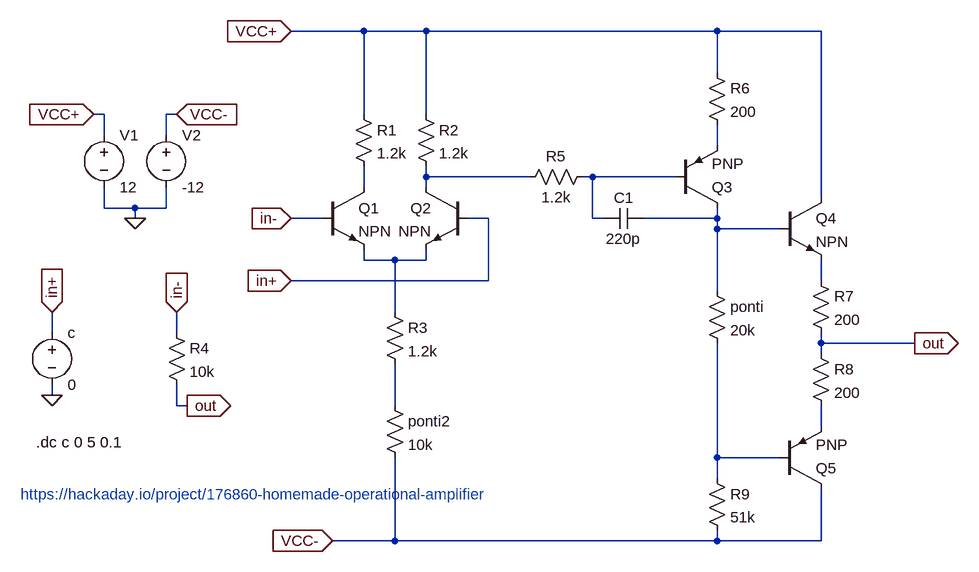
[diagram p0: schematic Discrete Opamp no offest.asc]
Discrete Opamp no offest.asc, the LTspice schematic file:
Version 4
SHEET 1 1092 680
WIRE 176 -160 64 -160
WIRE 272 -160 176 -160
WIRE 720 -160 272 -160
WIRE 880 -160 720 -160
WIRE 720 -96 720 -160
WIRE -224 -32 -240 -32
WIRE -112 -32 -128 -32
WIRE 176 -32 176 -160
WIRE 272 -32 272 -160
WIRE -224 0 -224 -32
WIRE -128 0 -128 -32
WIRE 720 16 720 -16
WIRE 272 64 272 48
WIRE 432 64 272 64
WIRE 528 64 512 64
WIRE 656 64 528 64
WIRE 176 80 176 48
WIRE 272 80 272 64
WIRE 880 96 880 -160
WIRE -224 112 -224 80
WIRE -176 112 -224 112
WIRE -128 112 -128 80
WIRE -128 112 -176 112
WIRE -176 128 -176 112
WIRE 112 128 64 128
WIRE 368 128 336 128
WIRE 528 128 528 64
WIRE 544 128 528 128
WIRE 720 128 720 112
WIRE 720 128 608 128
WIRE 720 144 720 128
WIRE 816 144 720 144
WIRE 176 192 176 176
WIRE 224 192 176 192
WIRE 272 192 272 176
WIRE 272 192 224 192
WIRE 368 224 368 128
WIRE 368 224 64 224
WIRE 880 224 880 192
WIRE 720 240 720 144
WIRE 224 272 224 192
WIRE -304 304 -304 272
WIRE -112 304 -112 272
WIRE 880 320 880 304
WIRE 1024 320 880 320
WIRE 880 336 880 320
WIRE -304 400 -304 384
WIRE -112 416 -112 384
WIRE -96 416 -112 416
WIRE 224 416 224 352
WIRE 880 448 880 416
WIRE 720 496 720 320
WIRE 816 496 720 496
WIRE 720 528 720 496
WIRE 224 624 224 496
WIRE 224 624 128 624
WIRE 720 624 720 608
WIRE 720 624 224 624
WIRE 880 624 880 544
WIRE 880 624 720 624
FLAG 1024 320 out
IOPIN 1024 320 Out
FLAG 64 224 in+
IOPIN 64 224 In
FLAG 64 128 in-
IOPIN 64 128 In
FLAG 64 -160 VCC+
IOPIN 64 -160 In
FLAG 128 624 VCC-
IOPIN 128 624 In
FLAG -240 -32 VCC+
IOPIN -240 -32 In
FLAG -112 -32 VCC-
IOPIN -112 -32 In
FLAG -176 128 0
FLAG -304 272 in+
IOPIN -304 272 In
FLAG -304 400 0
FLAG -112 272 in-
IOPIN -112 272 In
FLAG -96 416 out
IOPIN -96 416 Out
SYMBOL npn 112 80 R0
SYMATTR InstName Q1
SYMBOL npn 336 80 M0
SYMATTR InstName Q2
SYMBOL res 160 -48 R0
SYMATTR InstName R1
SYMATTR Value 1.2k
SYMBOL res 256 -48 R0
SYMATTR InstName R2
SYMATTR Value 1.2k
SYMBOL res 208 256 R0
SYMATTR InstName R3
SYMATTR Value 1.2k
SYMBOL res 208 400 R0
SYMATTR InstName ponti2
SYMATTR Value 10k
SYMBOL res 528 48 R90
WINDOW 0 0 56 VBottom 2
WINDOW 3 32 56 VTop 2
SYMATTR InstName R5
SYMATTR Value 1.2k
SYMBOL cap 608 112 R90
WINDOW 0 0 32 VBottom 2
WINDOW 3 32 32 VTop 2
SYMATTR InstName C1
SYMATTR Value 220p
SYMBOL pnp 656 112 M180
SYMATTR InstName Q3
SYMBOL res 704 -112 R0
SYMATTR InstName R6
SYMATTR Value 200
SYMBOL npn 816 96 R0
SYMATTR InstName Q4
SYMBOL res 864 208 R0
SYMATTR InstName R7
SYMATTR Value 200
SYMBOL res 864 320 R0
SYMATTR InstName R8
SYMATTR Value 200
SYMBOL pnp 816 544 M180
SYMATTR InstName Q5
SYMBOL res 704 512 R0
SYMATTR InstName R9
SYMATTR Value 51k
SYMBOL res 704 224 R0
SYMATTR InstName ponti
SYMATTR Value 20k
SYMBOL voltage -224 -16 R0
SYMATTR InstName V1
SYMATTR Value 12
SYMBOL voltage -128 -16 R0
SYMATTR InstName V2
SYMATTR Value -12
SYMBOL voltage -304 288 R0
SYMATTR InstName c
SYMATTR Value 0
SYMBOL res -128 288 R0
SYMATTR InstName R4
SYMATTR Value 10k
TEXT -328 472 Left 2 !.dc c 0 5 0.1
TEXT -352 552 Left 2 ;https://hackaday.io/project/176860-homemade-operational-amplifier

The netlist it stands for:
* Discrete Opamp no offest.asc
Q1 N004 in- N006 0 NPN
Q2 N002 in+ N006 0 NPN
R1 VCC+ N004 1.2k
R2 VCC+ N002 1.2k
R3 N006 N008 1.2k
R§ponti2 N008 VCC- 10k
R5 N003 N002 1.2k
C1 N005 N003 220p
Q3 N005 N003 N001 0 PNP
R6 VCC+ N001 200
Q4 VCC+ N005 N007 0 NPN
R7 N007 out 200
R8 out N009 200
Q5 VCC- N010 N009 0 PNP
R9 N010 VCC- 51k
R§ponti N005 N010 20k
V1 VCC+ 0 12
V2 VCC- 0 -12
V§c in+ 0 0
R4 in- out 10k
.model NPN NPN
.model PNP PNP
.lib standard.bjt
.dc c 0 5 0.1
* https://hackaday.io/project/176860-homemade-operational-amplifier
.backanno
.end